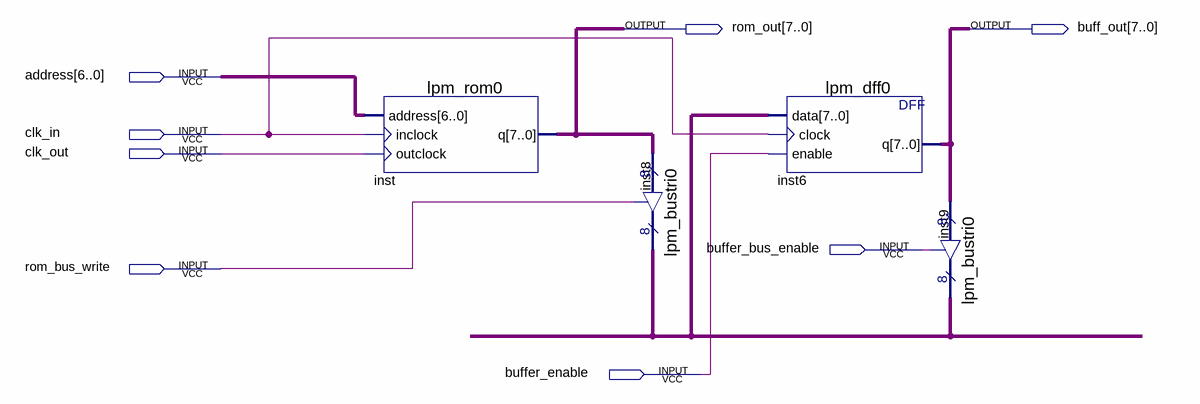
[diagram p0: schematic sheet]
// Quartus schematic tes.bdf as structural Verilog: 4 symbols, 8 pins
module tes (
  input  [6:0] address,
  input  clk_in,
  input  clk_out,
  input  buffer_bus_enable,
  input  rom_bus_write,
  input  buffer_enable,
  output [7:0] rom_out,
  output [7:0] buff_out
);

  wire [7:0] inst8_tridata;

  lpm_rom0 inst (.address(address), .inclock(clk_in), .outclock(clk_out), .q(rom_out));
  lpm_bustri0 inst8 (.enabledt(rom_bus_write), .data(rom_out), .tridata(inst8_tridata));
  lpm_dff0 inst6 (.data(inst8_tridata), .clock(clk_in), .enable(buffer_enable), .q(buff_out));
  lpm_bustri0 inst9 (.enabledt(buffer_bus_enable), .data(buff_out), .tridata(inst8_tridata));
endmodule
